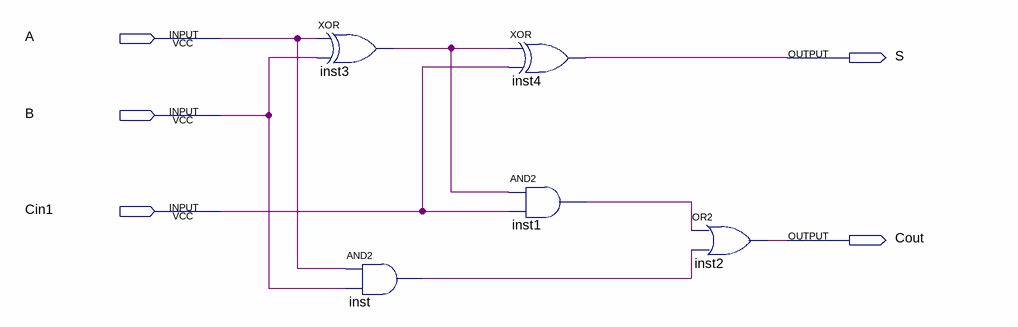
[diagram p0: schematic sheet]
// Quartus schematic fulladder.bdf as structural Verilog: 5 symbols, 5 pins
module fulladder (
  input  A,
  input  B,
  input  Cin1,
  output S,
  output Cout
);

  wire inst1_out, inst3_out, inst_out;

  xor inst3 (inst3_out, A, B);
  and inst (inst_out, A, B);
  xor inst4 (S, inst3_out, Cin1);
  and inst1 (inst1_out, inst3_out, Cin1);
  or inst2 (Cout, inst1_out, inst_out);
endmodule
